# Altium schematic sheet PHOTO_COMMUNICATION.SchDoc
size 420 x 297 mm; SheetNumber: 2; SheetTotal: 7
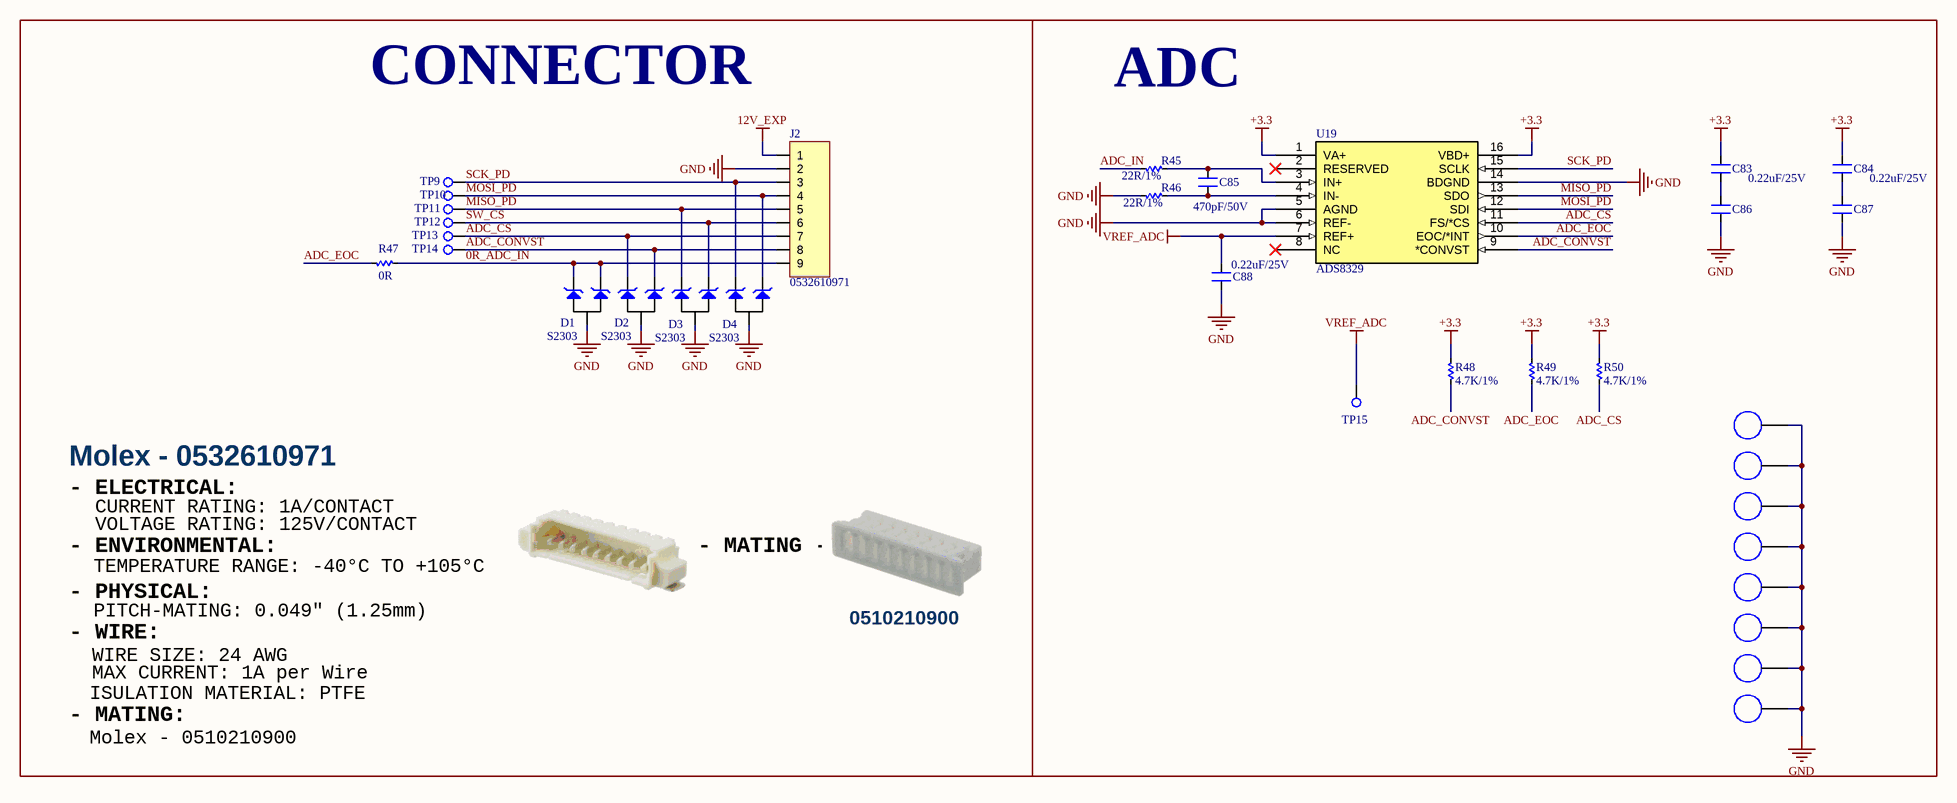
[diagram p0: PHOTO_COMMUNICATION.SchDoc]

## Parts
C83  0.22uF/25V  [CN-SMD-0603]
C84  0.22uF/25V  [CN-SMD-0603]
C85  470pF/50V  [CN-SMD-0603]
C86  0.22uF/25V  [CN-SMD-0603]  (value not drawn)
C87  0.22uF/25V  [CN-SMD-0603]  (value not drawn)
C88  0.22uF/25V  [CN-SMD-0603]
D1  S2303  [SOT23-123]
D2  S2303  [SOT23-123]
D3  S2303  [SOT23-123]
D4  S2303  [SOT23-123]
H5  HOLD  [HEX-M3_NoVia_Smaller]  (value not drawn)
H6  HOLD  [HEX-M3_NoVia_Smaller]  (value not drawn)
H7  HOLD  [HEX-M3_NoVia_Smaller]  (value not drawn)
H8  HOLD  [HEX-M3_NoVia_Smaller]  (value not drawn)
H9  HOLD  [HEX-M3_NoVia_Smaller]  (value not drawn)
H10  HOLD  [HEX-M3_NoVia_Smaller]  (value not drawn)
H11  HOLD  [HEX-M3_NoVia_Smaller]  (value not drawn)
H12  HOLD  [HEX-M3_NoVia_Smaller]  (value not drawn)
J2  0532610971  [0532610971]
R45  22R/1%  [RES-SMD-0603]
R46  22R/1%  [RES-SMD-0603]
R47  0R  [RES-SMD-0603]
R48  4.7K/1%  [RES-SMD-0603]
R49  4.7K/1%  [RES-SMD-0603]
R50  4.7K/1%  [RES-SMD-0603]
TP9  Test_Point  [TESTPOINT]  (value not drawn)
TP10  Test_Point  [TESTPOINT]  (value not drawn)
TP11  Test_Point  [TESTPOINT]  (value not drawn)
TP12  Test_Point  [TESTPOINT]  (value not drawn)
TP13  Test_Point  [TESTPOINT]  (value not drawn)
TP14  Test_Point  [TESTPOINT]  (value not drawn)
TP15  Test_Point  [TESTPOINT]  (value not drawn)
U19  ADS8329  [TSSOP16]

## Blocks framed on the sheet
CONNECTOR: D1-D4 J2 R47 TP9-TP14
ADC: C83-C88 H5-H12 R45 R46 R48-R50 TP15 U19

## Nets
12V_EXP: J2.1
+3.3: C83.2 C84.2 R48.2 R49.2 R50.2 U19.1(VA+) U19.16(VBD+)
GND: C86.1 C87.1 C88.1 D1.2 D2.2 D3.2 D4.2 H5.1 H6.1 H7.1 H8.1 H9.1 H10.1 H11.1 H12.1 J2.2 R46.2 U19.5(AGND) U19.6(REF-) U19.14(BDGND)
VREF_ADC: C88.2 TP15.1 U19.7(REF+)
0R_ADC_IN: D1.1 D1.3 J2.9 R47.1
ADC_CONVST: D2.3 J2.8 R48.1 TP14.1 U19.9(*CONVST)
ADC_CS: D2.1 J2.7 R50.1 TP13.1 U19.11(FS/*CS)
ADC_EOC: R47.2 R49.1 U19.10(EOC/*INT)
ADC_IN: R45.2
MISO_PD: D3.1 J2.5 TP11.1 U19.13(SDO)
MOSI_PD: D4.3 J2.4 TP10.1 U19.12(SDI)
SCK_PD: D4.1 J2.3 TP9.1 U19.15(SCLK)
SW_CS: D3.3 J2.6 TP12.1
NetC83_1: C83.1 C86.2
NetC84_1: C84.1 C87.2
NetC85_1: C85.1 R46.1 U19.4(IN-)
NetC85_2: C85.2 R45.1 U19.3(IN+)

Not connected (* = marked no-connect by the designer): U19 2(RESERVED)* 8(NC)*

## Notes on the sheet
- Molex - 0532610971
- - ELECTRICAL:
- CURRENT RATING: 1A/CONTACT
- VOLTAGE RATING: 125V/CONTACT
- - ENVIRONMENTAL:
- - PHYSICAL:
- TEMPERATURE RANGE: -40°C TO +105°C
- - MATING -
- - WIRE:
- WIRE SIZE: 24 AWG
- PITCH-MATING: 0.049" (1.25mm)
- 0510210900
- - MATING:
- ISULATION MATERIAL: PTFE
- MAX CURRENT: 1A per Wire
- Molex - 0510210900
- Project:
- Sub-system:
- Design by:
- Sheet title:
- Sheet
- of
- Checked by:
- Approved by:
- Revision:
- Document No:
- Size:
- Date:
- A3

## Library data of the parts
C83 C84 C86-C88 = CM: CL10B224KA8NNNC; Value: 103
C85 = CM: CL10B471KB8NNNC; Value: 103
H5-H12 = PAD_HOLD
J2 = JP9: Manufacturer: W¨¹rth Elektronik eiSos GmbH; partNo: 613009143121; ComponentLink1 Description: Manufacturer; ComponentLink2 Description: Datasheet; NoPins: 09; Created Date: 29 March 2013; ComponentLink1URL: http://www.we-online.com; ComponentLink2URL: http://katalog.we-online.de/em/datasheet/6130xx143121.pdf; Created by: Karrer Zheng
R45 R46 = Res-SMD: ERJ-3EKF22R0V; Manufacturer: Generic Components; Class: Passive; Published: 08/06/2000; Publisher: Altium Hobart Technology Centre
R47 = Res-SMD: ERJ-3GEY0R00V; Manufacturer: Generic Components; Class: Passive; Published: 08/06/2000; Publisher: Altium Hobart Technology Centre
R48-R50 = Res-SMD: ERJ-3EKF4701V; Manufacturer: Generic Components; Class: Passive; Published: 08/06/2000; Publisher: Altium Hobart Technology Centre
U19 = ADS8327: Supplier 1: Mouser; Supplier Part Number 1: 595-ADS8327IPW